# EAGLE board FindMeSAT_MB_1V3 (EAGLE 7.7.0), part 1 of 2
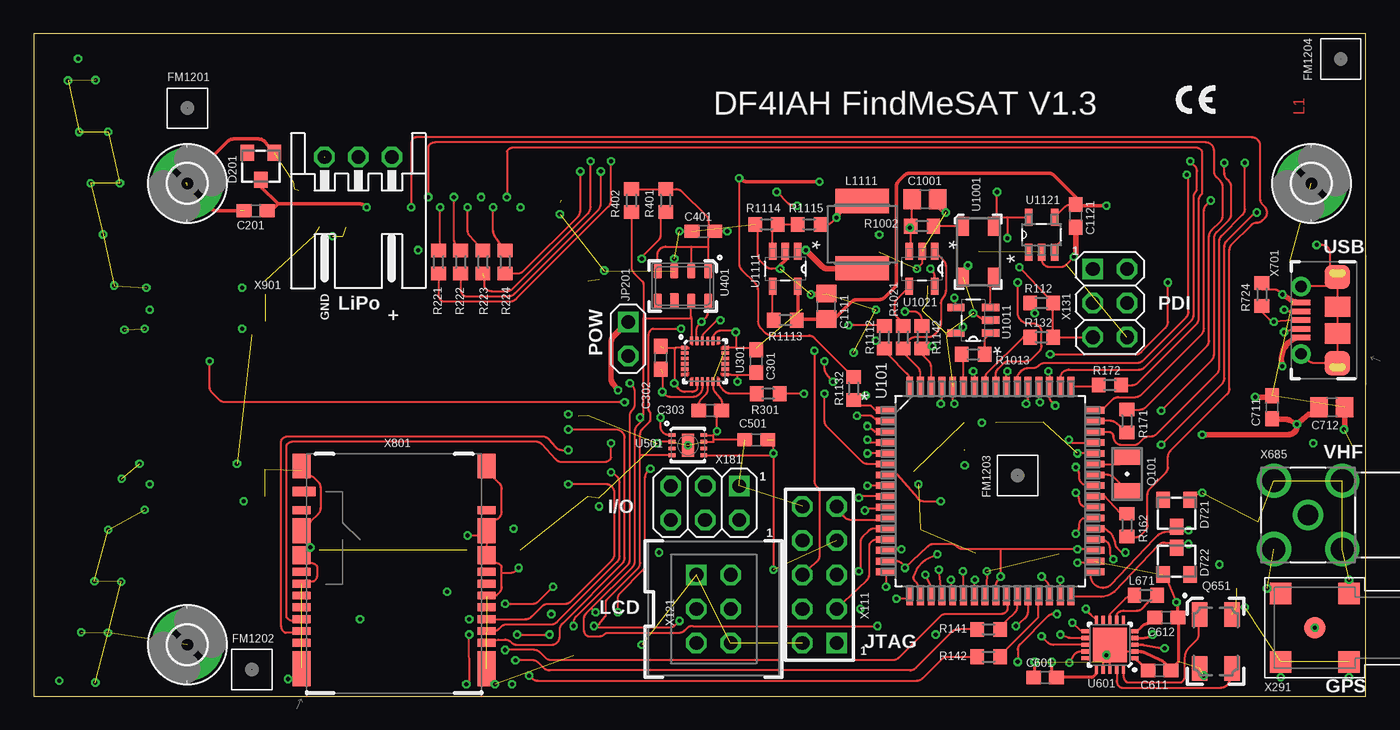
[diagram p12: board, top side]
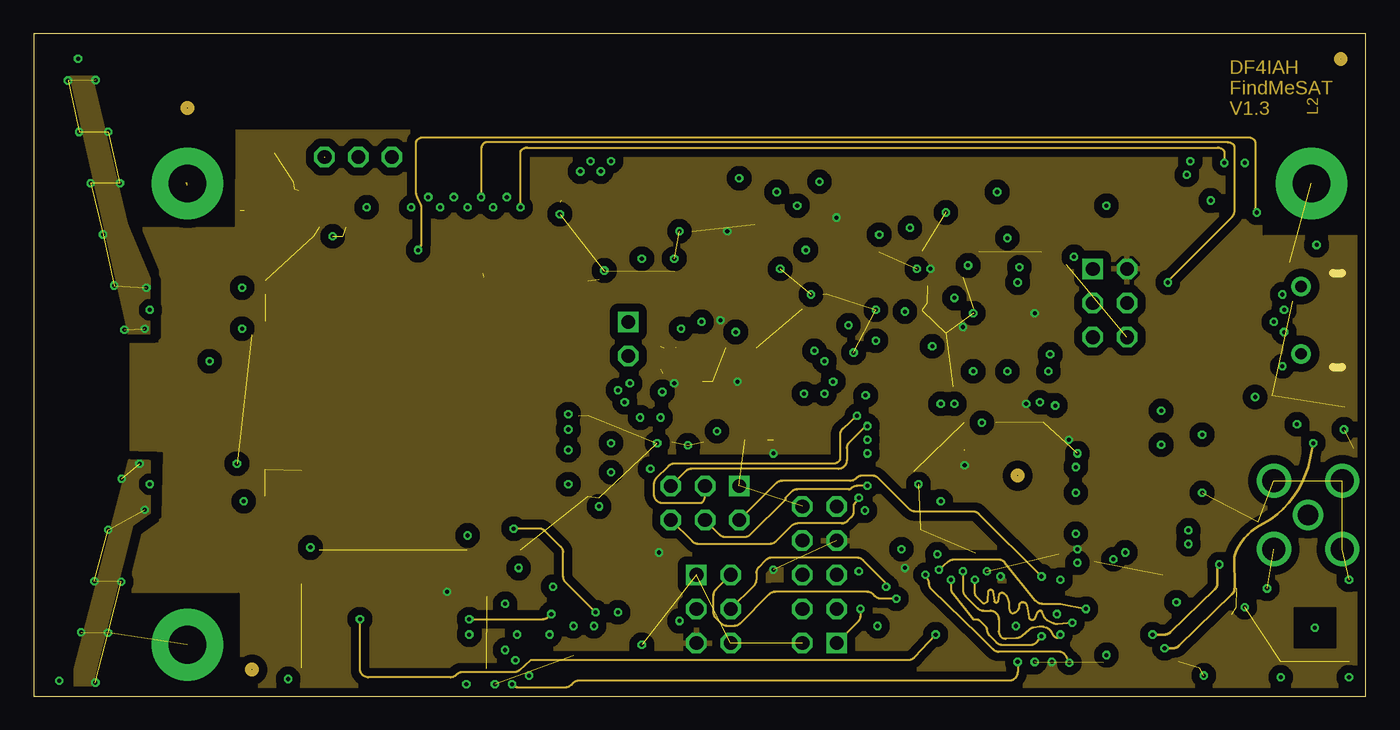
[diagram p13: board, inner layer Route2]
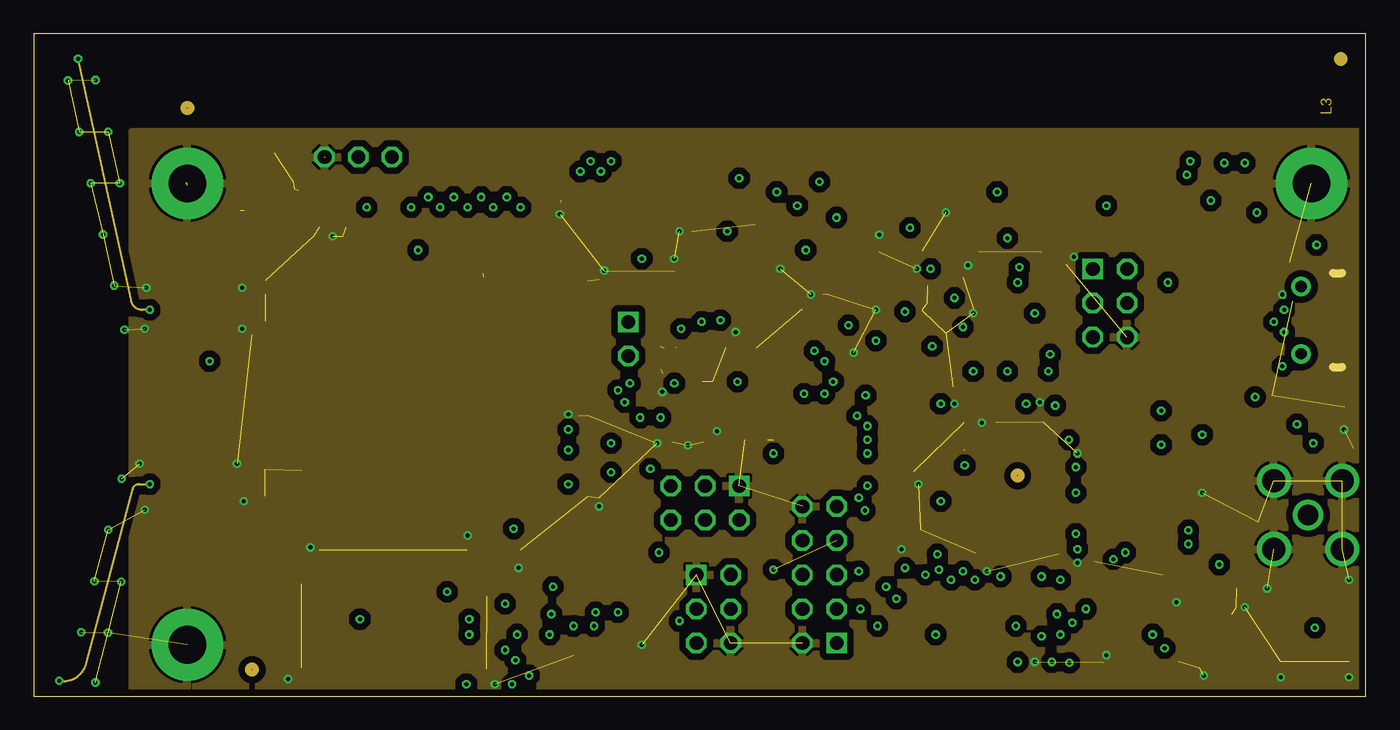
[diagram p14: board, inner layer Route15]
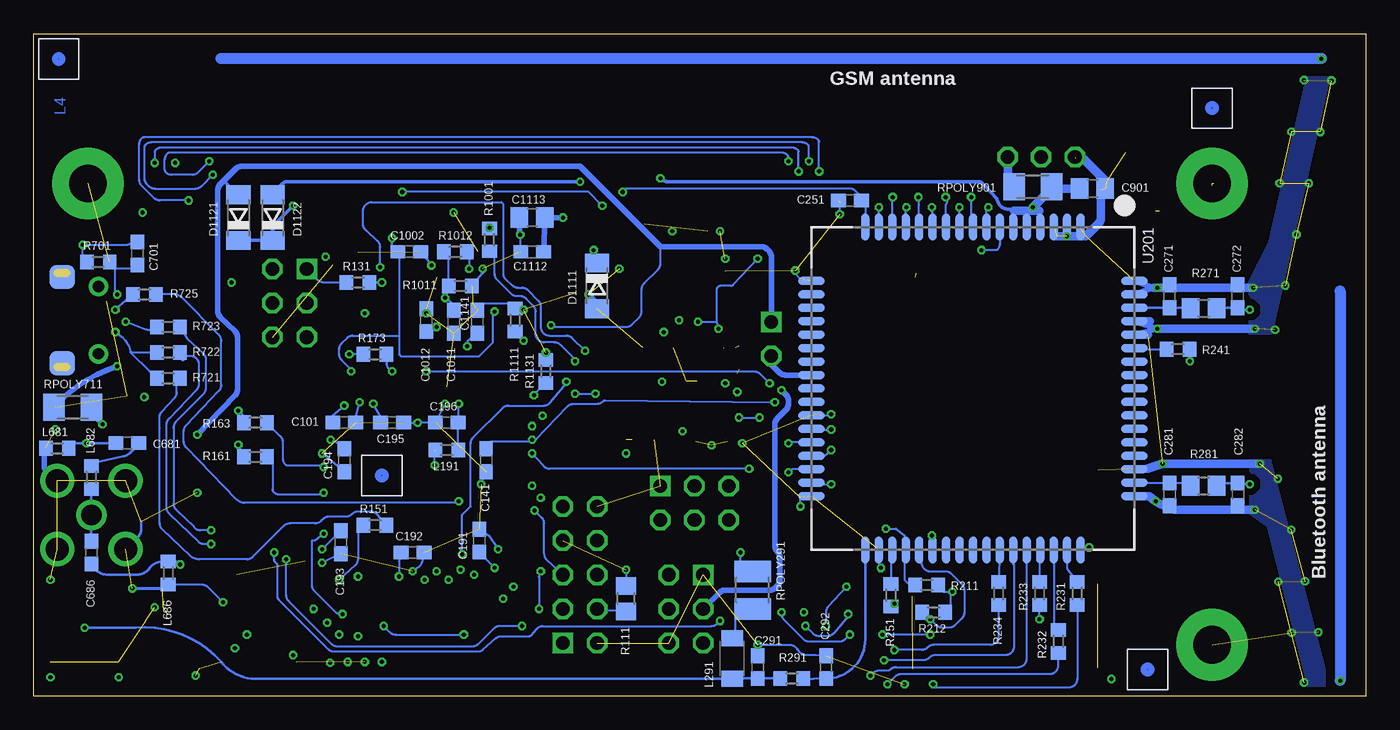
[diagram p15: board, bottom side, seen from below]

Size 99.04 x 49.23 mm. Coordinates in mm from the lower left corner, seen from the top.
Outline: 99.04,49.23 0,49.23 0,0 99.04,0 99.04,49.23
Copper layers (1+2*15+16): Top 0.035mm / dielectric 0.12mm / Route2 0.035mm / dielectric 1.2mm / Route15 0.035mm / dielectric 0.12mm / Bottom 0.035mm
Design rules "FindMeSAT_MB_1V2 *": minimum track width 6mil, minimum drill 12mil, track to track 6mil, track to pad 0.3mm, pad to pad 0.3mm, via to via 0.3mm, smd to smd 0mil, copper to edge 20mil, drill to drill 8mil, minimum pad ring 6mil, minimum via ring 6mil, stop-mask expansion 0.05mm, vias tented up to drill 0.35mm, thermal gap 0.2mm
Net classes: 1 pwr2A: width 0.8 mm; 2 R50: width 0.203 mm, clearance 0.9 mm; 3 R90_USB: width 0.15 mm, clearance 0.203 mm; 4 pwrA5: width 0.4 mm; 5 R75: width 0.15 mm, clearance 0.203 mm; 6 R110_SPI: width 0.15 mm, clearance 0.15 mm; 7 +3V3: clearance 0.5 mm; 8 GND: clearance 0.5 mm
tKeepout: area 0,0 to 99.1,49.2
bKeepout: area 0,0 to 99.1,49.2
tRestrict: area 21.6,1.3 to 31.8,17.8
bRestrict: area 19.1,12.7 to 39.4,33

## Footprints (pad centres in the part's own frame; a part is rotated, then mirrored left to right if it is on the bottom)
C0603 = smd 1.1 x 1: 1 -0.85,0; 2 0.85,0
C0805 = smd 1.3 x 1.5: 1 -0.95,0; 2 0.95,0
TO236 = smd 1 x 1.2: A -1,-1; C 0,1; NC 1,-1
SOD80C = smd 1.4 x 1.8: A 1.7,0; C -1.7,0
2,8-PAD = drill 2.8 pad 5.334: B2,8 0,0
1X02 = drill 1.016 square: 1 0,0 | drill 1.016 octagon: 2 0,2.54
R0603 = smd 1 x 1.1: 1 -0.85,0; 2 0.85,0
L3216C = smd 1.2 x 1.6: 1 -1.5,0; 2 1.5,0
L5650M = smd 1.8 x 4: 1 -2.5,0; 2 2.5,0
ABS07 = smd 1.1 x 1.9: 1 -1.25,0; 2 1.25,0
ABM03B = smd 1.8 x 1.2: 1 -2,-1.2; 2 2,-1.2; 3 2,1.2; 4 -2,1.2
R0805 = smd 1.3 x 1.5: 1 -0.95,0; 2 0.95,0
R1210 = smd 1.6 x 2.7: 1 -1.4,0; 2 1.4,0
M1206 = smd 1.6 x 2: 1 -1.4,0; 2 1.4,0
QFP80P1600X1600X120-64N = smd 1.473 x 0.508: 1 -7.747,5.994; 2 -7.747,5.207; 3 -7.747,4.394; 4 -7.747,3.607; 5 -7.747,2.794; 6 -7.747,2.007; 7 -7.747,1.194; 8 -7.747,0.406; 9 -7.747,-0.406; 10 -7.747,-1.194; 11 -7.747,-2.007; 12 -7.747,-2.794; 13 -7.747,-3.607; 14 -7.747,-4.394; 15 -7.747,-5.207; 16 -7.747,-5.994; 33 7.747,-5.994; 34 7.747,-5.207; 35 7.747,-4.394; 36 7.747,-3.607; 37 7.747,-2.794; 38 7.747,-2.007; 39 7.747,-1.194; 40 7.747,-0.406; 41 7.747,0.406; 42 7.747,1.194; 43 7.747,2.007; 44 7.747,2.794; 45 7.747,3.607; 46 7.747,4.394; 47 7.747,5.207; 48 7.747,5.994 | smd 0.508 x 1.473: 17 -5.994,-7.747; 18 -5.207,-7.747; 19 -4.394,-7.747; 20 -3.607,-7.747; 21 -2.794,-7.747; 22 -2.007,-7.747; 23 -1.194,-7.747; 24 -0.406,-7.747; 25 0.406,-7.747; 26 1.194,-7.747; 27 2.007,-7.747; 28 2.794,-7.747; 29 3.607,-7.747; 30 4.394,-7.747; 31 5.207,-7.747; 32 5.994,-7.747; 49 5.994,7.747; 50 5.207,7.747; 51 4.394,7.747; 52 3.607,7.747; 53 2.794,7.747; 54 2.007,7.747; 55 1.194,7.747; 56 0.406,7.747; 57 -0.406,7.747; 58 -1.194,7.747; 59 -2.007,7.747; 60 -2.794,7.747; 61 -3.607,7.747; 62 -4.394,7.747; 63 -5.207,7.747; 64 -5.994,7.747
SIM808 = smd 2 x 0.6: 1 -12,8; 2 -12,7; 3 -12,6; 4 -12,5; 5 -12,4; 6 -12,3; 7 -12,2; 8 -12,1; 9 -12,0; 10 -12,-1; 11 -12,-2; 12 -12,-3; 13 -12,-4; 14 -12,-5; 15 -12,-6; 16 -12,-7; 17 -12,-8; 35 12,-8; 36 12,-7; 37 12,-6; 38 12,-5; 39 12,-4; 40 12,-3; 41 12,-2; 42 12,-1; 43 12,0; 44 12,1; 45 12,2; 46 12,3; 47 12,4; 48 12,5; 49 12,6; 50 12,7; 51 12,8 | smd 0.6 x 2: 18 -8,-12; 19 -7,-12; 20 -6,-12; 21 -5,-12; 22 -4,-12; 23 -3,-12; 24 -2,-12; 25 -1,-12; 26 0,-12; 27 1,-12; 28 2,-12; 29 3,-12; 30 4,-12; 31 5,-12; 32 6,-12; 33 7,-12; 34 8,-12; 52 8,12; 53 7,12; 54 6,12; 55 5,12; 56 4,12; 57 3,12; 58 2,12; 59 1,12; 60 0,12; 61 -1,12; 62 -2,12; 63 -3,12; 64 -4,12; 65 -5,12; 66 -6,12; 67 -7,12; 68 -8,12
QFN24-3X3 = smd 0.495 x 0.25: 1 -1.552,1; 6 -1.552,-1; 13 1.552,-1; 18 1.552,1 | smd 0.6 x 0.25: 2 -1.5,0.6; 3 -1.5,0.2; 4 -1.5,-0.2; 5 -1.5,-0.6; 14 1.5,-0.6; 15 1.5,-0.2; 16 1.5,0.2; 17 1.5,0.6 | smd 0.25 x 0.495: 7 -1,-1.552; 12 1,-1.552; 19 1,1.552; 24 -1,1.552 | smd 0.25 x 0.6: 8 -0.6,-1.5; 9 -0.2,-1.5; 10 0.2,-1.5; 11 0.6,-1.5; 20 0.6,1.5; 21 0.2,1.5; 22 -0.2,1.5; 23 -0.6,1.5
MS5607-02BA = smd 1.1 x 0.6: 1 -1.1,1.875; 2 -1.1,0.625; 3 -1.1,-0.625; 4 -1.1,-1.875; 5 1.1,-1.875; 7 1.1,0.625; 8 1.1,1.875 | smd 1.1 x 0.67: 6 1.1,-0.625
DFN8/SHT = smd 0.55 x 0.25: 1 -1.177,0.765; 2 -1.177,0.265; 3 -1.177,-0.235; 4 -1.177,-0.735; 5 1.173,-0.735; 6 1.173,-0.235; 7 1.173,0.265; 8 1.173,0.765 | smd 0.9 x 1.7: 9 -0.002,0.015
QFN20-4X4-0P5-PAD = smd 0.6 x 0.3: 1 -1.85,1; 2 -1.85,0.5; 3 -1.85,0; 4 -1.85,-0.5; 5 -1.85,-1; 11 1.85,-1; 12 1.85,-0.5; 13 1.85,0; 14 1.85,0.5; 15 1.85,1 | smd 0.3 x 0.6: 6 -1,-1.85; 7 -0.5,-1.85; 8 0,-1.85; 9 0.5,-1.85; 10 1,-1.85; 16 1,1.85; 17 0.5,1.85; 18 0,1.85; 19 -0.5,1.85; 20 -1,1.85 | smd 2.55 x 2.55: 21 0,0
CFPT-141 = smd 0.9 x 1.4: 1 -1.15,1.9; 2 -1.15,-1.9; 3 1.15,-1.9; 4 1.15,1.9
SOT-23-5 = smd 1.27 x 0.559: 1 -1.295,0.94; 2 -1.295,0; 3 -1.295,-0.94; 4 1.295,-0.94; 5 1.295,0.94
SOT95P280X145-5N = smd 1.27 x 0.559: 1 -1.295,0.94; 2 -1.295,0; 3 -1.295,-0.94; 4 1.295,-0.94; 5 1.295,0.94
SOT95P285X120-5N = smd 1.27 x 0.533: 1 -1.295,0.965; 2 -1.295,0; 3 -1.295,-0.965; 4 1.295,-0.965; 5 1.295,0.965
AVR-JTAG-10 = drill 1.016 square: 1 -5.08,-1.27 | drill 1.016 octagon: 2 -5.08,1.27; 3 -2.54,-1.27; 4 -2.54,1.27; 5 0,-1.27; 6 0,1.27; 7 2.54,-1.27; 8 2.54,1.27; 9 5.08,-1.27; 10 5.08,1.27
MOLEX_90130_2X03 = drill 1.016 square: 1 -2.54,-1.27 | drill 1.016 octagon: 2 -2.54,1.27; 3 0,-1.27; 4 0,1.27; 5 2.54,-1.27; 6 2.54,1.27
2X03 = drill 1.016 square: 1 -2.54,-1.27 | drill 1.016 octagon: 2 -2.54,1.27; 3 0,-1.27; 4 0,1.27; 5 2.54,-1.27; 6 2.54,1.27
MCX-J-P-X-RA-SM1 = smd 1.6 x 1.6: 1 0,0; 2 -2.54,2.54; 3 2.54,2.54; 4 -2.54,-2.54; 5 2.54,-2.54
SMA_SMT_AMPHENOL_901-143 = drill 1.499: 1 0,0 | drill 1.702: 2 -2.54,2.54; 3 -2.54,-2.54; 4 2.54,-2.54; 5 2.54,2.54
USB-B-MICRO-SMD_MOLEX-105017-0001 = smd 0.4 x 1.35: D+ 0,4.15; D- -0.65,4.15; GND 1.3,4.15; ID 0.65,4.15; VBUS -1.3,4.15 | drill 0.85 pad 1.45: JSHIELD -2.5,4.15; JSHIELD@2 2.5,4.15 | smd 1.8 x 1.9 bottom: JSHIELD@1 -3.2,1.45; JSHIELD@7 3.2,1.45 | smd 1.8 x 1.9: JSHIELD@3 -3.2,1.45; JSHIELD@6 3.2,1.45 | smd 1.5 x 1.9: JSHIELD@4 -1,1.45; JSHIELD@5 1,1.45
MICROSIM-8P_SDCARD-8P_MOLEX-104642-1610 = smd 1.35 x 2.6: G1 -6.875,-7.04; G8 6.875,-7.04 | smd 1.35 x 1.34: G2 -6.875,1.36; G7 6.875,1.36 | smd 1.35 x 1.84: G3 -6.875,3.2; G6 6.875,3.2 | smd 1.35 x 1.8: G4 -6.875,8.01; G5 6.875,8.01 | smd 1.35 x 0.58: S1 6.875,-5.13; S2 6.875,-4.25; S3 -6.875,-4.25; S4 -6.875,-5.13; S5 6.875,-1.61; S6 6.875,-3.37; S7 -6.875,-3.37; S8 -6.875,-1.61; T1 6.875,4.71; T2 6.875,0.15; T3 6.875,-0.73; T4 6.875,-2.49; T5 -6.875,-2.49; T6 -6.875,-0.73; T7 -6.875,0.15; T8 -6.875,4.71 | smd 1.7 x 0.7: SW -6.7,6.125
JST_S3B-XH-A = drill 1.016 octagon: 1 -2.5,-4.5; 2 0,-4.5; 3 2.5,-4.5

## Placement (x,y rotation side)
C101  100nF  [C0603]  75.95,20.32 0 bottom
C141  100pF  [C0603]  65.41,17.53 270 bottom
C191  100nF  [C0603]  65.91,11.56 90 bottom
C192  100nF  [C0603]  70.87,10.67 0 bottom
C193  100nF  [C0603]  76.2,11.43 270 bottom
C194  100nF  [C0603]  75.95,17.53 270 bottom
C195  100nF  [C0603]  72.39,20.32 0 bottom
C196  100nF  [C0603]  68.33,20.32 180 bottom
C201  100pF  [C0603]  16.51,36.07 180 top
C251  100pF  [C0603]  38.35,36.83 180 bottom
C271  [C0603]  14.61,29.72 90 bottom
C272  [C0603]  9.53,29.72 90 bottom
C281  [C0603]  14.61,14.99 270 bottom
C282  [C0603]  9.53,14.99 270 bottom
C291  [C0603]  45.21,2.16 90 bottom
C292  [C0603]  40.13,2.16 90 bottom
C301  100nF  [C0603]  53.72,24.89 90 top
C302  10nF  [C0603]  46.61,25.15 270 top
C303  100nF  [C0603]  50.29,21.21 0 top
C401  100nF  [C0603]  49.78,34.54 180 top
C501  100nF  [C0603]  53.72,19.05 180 top
C601  100nF  [C0603]  75.18,1.4 180 top
C611  100nF  [C0603]  83.69,1.91 0 top
C612  100nF  [C0603]  84.2,5.84 0 top
C681  47pF  [C0603]  92.08,18.8 0 bottom
C686  3.9pF  [C0603]  94.74,10.67 90 bottom
C701  1nF  [C0603]  91.31,32.89 270 bottom
C711  100nF  [C0603]  92.08,21.46 90 top
C712  47uF  [C0805]  96.52,21.46 0 top
C901  100uF  [C0805]  20.32,37.72 0 bottom
C1001  10uF  [C0805]  66.27,36.92 0 top
C1002  100nF  [C0603]  71.12,33.02 0 bottom
C1011  100pF  [C0603]  67.82,27.81 270 bottom
C1012  100nF  [C0603]  69.85,27.94 90 bottom
C1111  47uF  [C0805]  58.93,28.96 90 top
C1112  100nF  [C0603]  61.98,33.02 180 bottom
C1113  47uF  [C0805]  61.98,35.56 180 bottom
C1121  100nF  [C0603]  77.47,35.69 270 top
C1141  100pF  [C0603]  66.04,27.81 90 bottom
D201  BZX84-5V1  [TO236]  16.89,39.37 180 top
D721  BZX84-3V6  [TO236]  84.96,13.59 180 top
D722  BZX84-3V6  [TO236]  84.96,10.03 0 top
D1111  CRS08  [SOD80C]  57.15,30.48 270 bottom
D1121  CRS08  [SOD80C]  83.82,35.56 90 bottom
D1122  CRS08  [SOD80C]  81.28,35.56 90 bottom
FM1201  FIDUCIAL_MARK_1MM  [FIDUCIAL_MARK_1MM]  11.43,43.69 0 top
FM1202  FIDUCIAL_MARK_1MM  [FIDUCIAL_MARK_1MM]  16.24,1.97 0 top
FM1203  FIDUCIAL_MARK_1MM  [FIDUCIAL_MARK_1MM]  73.15,16.38 0 top
FM1204  FIDUCIAL_MARK_1MM  [FIDUCIAL_MARK_1MM]  97.17,47.36 0 top
H1201  MOUNT-PAD-ROUND2.8  [2,8-PAD]  95,38.1 180 top
H1203  MOUNT-PAD-ROUND2.8  [2,8-PAD]  11.43,38.1 180 top
H1204  MOUNT-PAD-ROUND2.8  [2,8-PAD]  11.43,3.81 180 top
JP201  POW  [1X02]  44.2,27.81 180 top
L191  10uH  [R0603]  68.33,18.29 180 bottom
L291  WE-CBF_300R  [L3216C]  47.12,2.79 270 bottom
L671  22nH  [R0603]  82.68,7.49 0 top
L681  150nH  [R0603]  97.28,18.41 180 bottom
L682  47nH  [R0603]  94.74,16.26 270 bottom
L686  18nH  [R0603]  89.03,9.14 90 bottom
L1111  4.7uH  [L5650M]  61.59,34.29 270 top
Q101  ABS07-32.768KHZ  [ABS07]  81.28,16.51 90 top
Q651  ABM3B-16MHZ-10-R50-1-U  [ABM03B]  87.88,4.06 270 top
R111  0R  [R0805]  54.99,7.24 90 bottom
R112  10kR  [R0603]  74.93,29.21 180 top
R131  68R  [R0603]  74.93,30.73 0 bottom
R132  68R  [R0603]  74.93,26.67 180 top
R141  10kR  [R0603]  70.99,4.95 180 top
R142  10kR  [R0603]  70.99,2.92 180 top
R151  68R  [R0603]  73.66,12.7 0 bottom
R161  4.7kR  [R0603]  82.55,17.78 180 bottom
R162  10kR  [R0603]  81.28,12.7 270 top
R163  10kR  [R0603]  82.55,20.32 180 bottom
R171  10kR  [R0603]  81.28,20.45 90 top
R172  10kR  [R0603]  80.01,23.11 0 top
R173  10kR  [R0603]  73.66,25.4 180 bottom
R211  10kR  [R0603]  32.64,8.26 180 bottom
R212  10kR  [R0603]  32.13,6.22 180 bottom
R221  68R  [R0603]  30.1,32.26 90 top
R222  68R  [R0603]  31.75,32.26 90 top
R223  68R  [R0603]  33.4,32.26 90 top
R224  68R  [R0603]  35.05,32.26 90 top
R231  68R  [R0603]  21.46,7.62 270 bottom
R232  68R  [R0603]  22.86,4.06 270 bottom
R233  68R  [R0603]  24.26,7.62 270 bottom
R234  68R  [R0603]  27.3,7.62 270 bottom
R241  68R  [R0603]  13.97,25.78 0 bottom
R251  68R  [R0603]  35.31,7.49 90 bottom
R271  [R0805]  12.06,28.83 0 bottom
R281  [R0805]  12.06,15.64 0 bottom
R291  [R0603]  42.67,1.31 0 bottom
R301  68R  [R0603]  54.61,22.48 0 top
R401  10kR  [R0603]  46.99,36.83 90 top
R402  10kR  [R0603]  44.45,36.83 90 top
R701  330kR  [R0603]  94.23,32.26 0 bottom
R721  1.5kR  [R0603]  89.03,23.62 0 bottom
R722  68R  [R0603]  89.03,25.53 0 bottom
R723  68R  [R0603]  89.03,27.43 0 bottom
R724  1MR  [R0603]  91.31,29.84 90 top
R725  68R  [R0603]  90.81,29.84 0 bottom
R1001  100kR  [R0603]  65.15,33.91 90 bottom
R1002  10kR  [R0603]  66.04,34.92 0 top
R1011  100kR  [R0603]  67.31,30.48 180 bottom
R1012  330kR  [R0603]  67.69,33.02 0 bottom
R1013  47R  [R0603]  69.85,25.4 180 top
R1021  27R  [R0603]  64.64,26.67 270 top
R1111  4.02kR  [R0603]  63.25,27.94 270 bottom
R1112  6.04kR  [R0603]  63.25,26.67 90 top
R1113  100kR  [R0603]  55.88,27.94 180 top
R1114  15kR  [R0603]  54.48,35.05 0 top
R1115  68kR  [R0603]  57.66,35.05 0 top
R1131  4.02kR  [R0603]  60.96,24.13 90 bottom
R1132  6.04kR  [R0603]  60.96,22.86 270 top
R1142  2.0kR  [R0603]  66.04,26.67 90 top
RPOLY291  50mA/150mA  [R1210]  45.59,7.87 90 bottom
RPOLY711  1.1A/2.2A  [M1206]  96.14,21.46 0 bottom
RPOLY901  1.1A/2.2A  [M1206]  24.77,37.85 0 bottom
U101  ATXMEGA256A3BU-AU  [QFP80P1600X1600X120-64N]  71.12,15.24 0 top
U201  SIM808  [SIM808]  29.21,22.86 270 bottom
U301  MPU-9250  [QFN24-3X3]  49.91,24.89 0 top
U401  MS5607-02BA03  [MS5607-02BA]  48.26,30.48 270 top
U501  SHT31-DIS  [DFN8/SHT]  48.64,18.63 0 top
U601  AX5243  [QFN20-4X4-0P5-PAD]  80.01,3.81 180 top
U1001  CFPT-141-20MHZ  [CFPT-141]  70.23,33.02 0 top
U1011  OPA354  [SOT-23-5]  69.85,27.94 180 top
U1021  OPA354  [SOT-23-5]  66.04,31.75 270 top
U1111  LM2831YMF  [SOT95P280X145-5N]  55.88,31.75 270 top
U1121  LM4120IM5-3.0  [SOT95P285X120-5N]  74.93,34.29 90 top
X111  AVR-JTAG-10  [AVR-JTAG-10]  58.42,9.02 90 top
X121  MOLEX_90130_2X03  [MOLEX_90130_2X03]  50.55,6.48 270 top
X131  HEADER-2X3  [2X03]  80.01,29.21 270 top
X181  HEADER-2X3  [2X03]  49.91,14.35 180 top
X291  MCX-J-P-X-RA-SM1  [MCX-J-P-X-RA-SM1]  95.25,5.08 270 top
X685  SMA_CON  [SMA_SMT_AMPHENOL_901-143]  94.74,13.46 270 top
X701  MOLEX_105017-0001  [USB-B-MICRO-SMD_MOLEX-105017-0001]  98.38,27.94 90 top
X801  MICROSIM-8P_SDCARD-8P_MOLEX-104642-1610  [MICROSIM-8P_SDCARD-8P_MOLEX-104642-1610]  26.8,9.09 0 top
X901  JST_S3B-XH-A  [JST_S3B-XH-A]  24.13,35.56 180 top